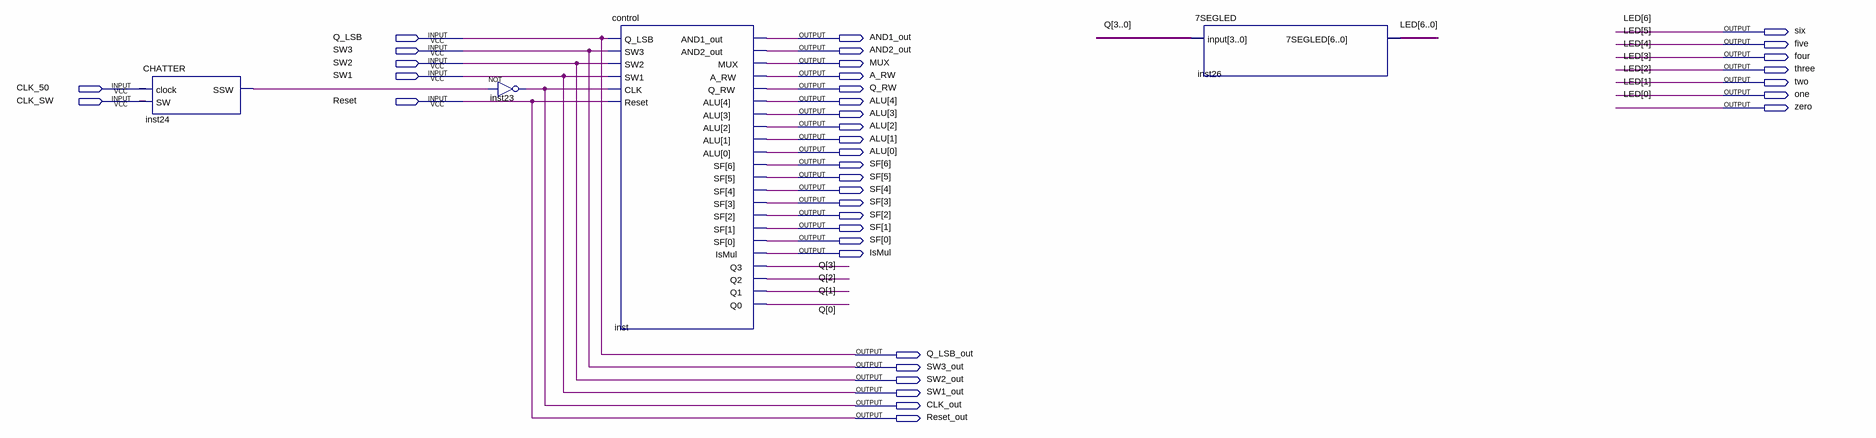
[diagram p0: schematic sheet]
// Quartus schematic control_module.bdf as structural Verilog: 4 symbols, 38 pins
module control_module (
  input  Q_LSB,
  input  SW3,
  input  SW2,
  input  SW1,
  input  CLK_50,
  input  CLK_SW,
  input  Reset,
  output six,
  output AND1_out,
  output five,
  output AND2_out,
  output four,
  output MUX,
  output three,
  output A_RW,
  output two,
  output Q_RW,
  output one,
  output [4:0] ALU,
  output zero,
  output [6:0] SF,
  output IsMul,
  output Q_LSB_out,
  output SW3_out,
  output SW2_out,
  output SW1_out,
  output CLK_out,
  output Reset_out
);

  wire inst24_ssw;
  wire [3:0] Q;

  CHATTER inst24 (.clock(CLK_50), .SW(CLK_SW), .SSW(inst24_ssw));
  not inst23 (CLK_out, inst24_ssw);
  control inst (
    .Q_LSB(Q_LSB), .SW3(SW3), .SW2(SW2), .SW1(SW1), .CLK(CLK_out), .Reset(Reset), .AND1_out(AND1_out),
    .AND2_out(AND2_out), .MUX(MUX), .A_RW(A_RW), .Q_RW(Q_RW), .ALU(ALU), .SF(SF), .IsMul(IsMul), .Q3(Q[3]),
    .Q2(Q[2]), .Q1(Q[1]), .Q0(Q[0]));
  \7SEGLED  inst26 (.\input (Q), .\7SEGLED ({six, five, four, three, two, one, zero}));

  assign Q_LSB_out = Q_LSB;
  assign Reset_out = Reset;
  assign SW1_out = SW1;
  assign SW2_out = SW2;
  assign SW3_out = SW3;

  // Other names for the same wires on the sheet: LED[6:0] = {six, five, four, three, two, one, zero}
endmodule
